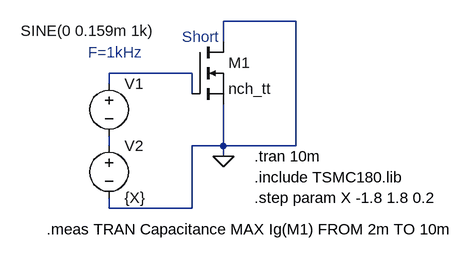
[diagram p0: schematic Prob_2a2.asc]
Prob_2a2.asc, the LTspice schematic file:
Version 4
SHEET 1 880 680
WIRE 288 -32 176 -32
WIRE 176 0 176 -32
WIRE 128 48 0 48
WIRE 0 64 0 48
WIRE 128 80 128 48
WIRE 0 160 0 144
WIRE 176 160 176 96
WIRE 176 160 128 160
WIRE 288 160 288 -32
WIRE 288 160 176 160
WIRE 176 176 176 160
WIRE 0 256 0 240
WIRE 128 256 128 160
WIRE 128 256 0 256
FLAG 176 176 0
SYMBOL voltage 0 48 R0
WINDOW 3 -136 -65 Left 2
WINDOW 123 0 0 Left 0
WINDOW 39 0 0 Left 0
SYMATTR Value SINE(0 0.159m 1k)
SYMATTR InstName V1
SYMBOL nmos 128 0 R0
SYMATTR InstName M1
SYMATTR Value nch_tt
SYMATTR Value2 w=114nm l=180nm
SYMBOL voltage 0 144 R0
WINDOW 123 0 0 Left 0
WINDOW 39 0 0 Left 0
SYMATTR InstName V2
SYMATTR Value {X}
TEXT 224 208 Left 2 !.include TSMC180.lib
TEXT -32 16 Left 2 ;F=1kHz
TEXT 112 -8 Left 2 ;Short
TEXT 224 240 Left 2 !.step param X -1.8 1.8 0.2
TEXT 224 176 Left 2 !.tran 10m
TEXT -96 288 Left 2 !.meas TRAN Capacitance MAX Ig(M1) FROM 2m TO 10m

The netlist it stands for:
* Prob_2a2.asc
V1 N001 N002 SINE(0 0.159m 1k)
M1 0 N001 0 0 nch_tt w=114nm l=180nm
V2 N002 0 {X}
.model NMOS NMOS
.model PMOS PMOS
.lib standard.mos
.include TSMC180.lib
* F=1kHz
* Short
.step param X -1.8 1.8 0.2
.tran 10m
.meas TRAN Capacitance MAX Ig(M1) FROM 2m TO 10m
.backanno
.end